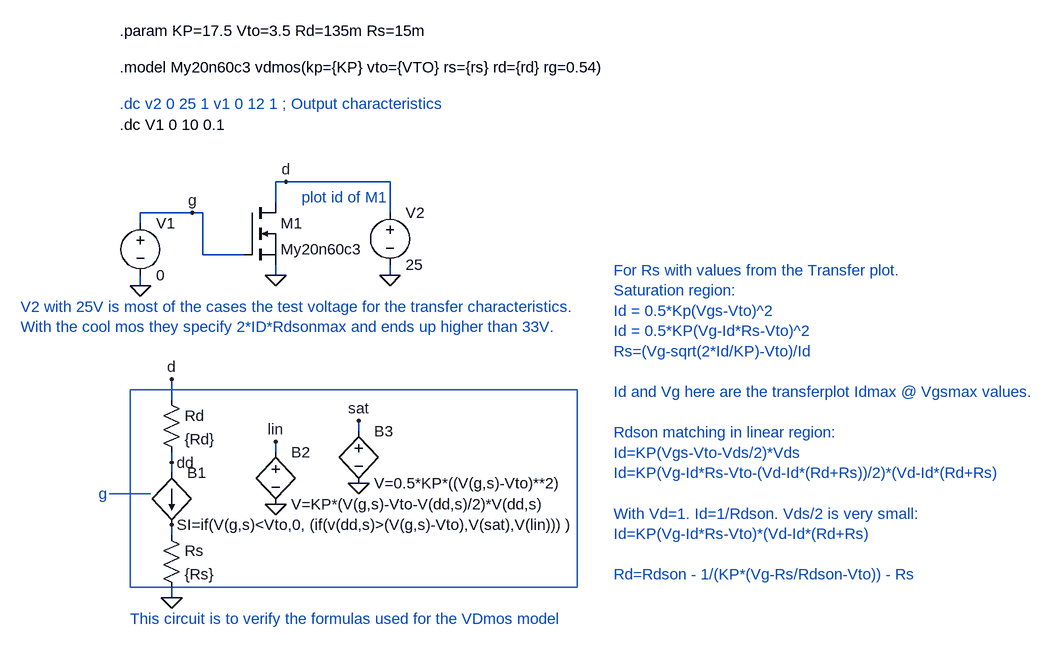
[diagram p0: schematic DC-level1.asc]
DC-level1.asc, the LTspice schematic file:
Version 4
SHEET 1 2604 832
WIRE 816 144 800 144
WIRE 976 144 816 144
WIRE 800 176 800 144
WIRE 672 192 592 192
WIRE 688 192 672 192
WIRE 976 192 976 144
WIRE 592 208 592 192
WIRE 688 256 688 192
WIRE 752 256 688 256
WIRE 800 288 800 272
WIRE 976 288 976 272
WIRE 592 304 592 288
WIRE 640 480 640 448
WIRE 928 528 928 512
WIRE 800 560 800 544
WIRE 640 576 640 560
WIRE 640 592 640 576
WIRE 640 688 640 672
WIRE 640 784 640 768
FLAG 800 288 0
FLAG 592 304 0
FLAG 976 288 0
FLAG 672 192 g
FLAG 816 144 d
FLAG 640 784 0
FLAG 640 448 d
FLAG 800 640 0
FLAG 928 608 0
FLAG 800 544 lin
FLAG 928 512 sat
FLAG 640 672 S
FLAG 640 576 dd
SYMBOL nmos 752 176 R0
SYMATTR InstName M1
SYMATTR Value My20n60c3
SYMBOL voltage 592 192 R0
WINDOW 123 0 0 Left 0
WINDOW 39 0 0 Left 0
SYMATTR InstName V1
SYMATTR Value 0
SYMBOL bi 640 592 R0
SYMATTR InstName B1
SYMATTR Value I=if(V(g,s)<Vto,0, (if(v(dd,s)>(V(g,s)-Vto),V(sat),V(lin))) )
SYMBOL res 624 672 R0
SYMATTR InstName Rs
SYMATTR Value {Rs}
SYMBOL res 624 464 R0
SYMATTR InstName Rd
SYMATTR Value {Rd}
SYMBOL bv 800 544 R0
SYMATTR InstName B2
SYMATTR Value V=KP*(V(g,s)-Vto-V(dd,s)/2)*V(dd,s)
SYMBOL bv 928 512 R0
SYMATTR InstName B3
SYMATTR Value V=0.5*KP*((V(g,s)-Vto)**2)
SYMBOL voltage 976 176 R0
WINDOW 123 0 0 Left 0
WINDOW 39 0 0 Left 0
SYMATTR InstName V2
SYMATTR Value 25
TEXT 560 -32 Left 0 !.model My20n60c3 vdmos(kp={KP} vto={VTO} rs={rs} rd={rd} rg=0.54)
TEXT 560 24 Left 0 ;.dc v2 0 25 1 v1 0 12 1 ; Output characteristics
TEXT 560 56 Left 0 !.dc V1 0 10 0.1
TEXT 840 168 Left 0 ;plot id of M1
TEXT 560 -88 Left 0 !.param KP=17.5 Vto=3.5 Rd=135m Rs=15m
TEXT 1320 280 Left 0 ;For Rs with values from the Transfer plot.\nSaturation region:\nId = 0.5*Kp(Vgs-Vto)^2\nId = 0.5*KP(Vg-Id*Rs-Vto)^2\nRs=(Vg-sqrt(2*Id/KP)-Vto)/Id\n \nId and Vg here are the transferplot Idmax @ Vgsmax values.\n \nRdson matching in linear region:\nId=KP(Vgs-Vto-Vds/2)*Vds\nId=KP(Vg-Id*Rs-Vto-(Vd-Id*(Rd+Rs))/2)*(Vd-Id*(Rd+Rs)\n \nWith Vd=1. Id=1/Rdson. Vds/2 is very small:\nId=KP(Vg-Id*Rs-Vto)*(Vd-Id*(Rd+Rs)\n \nRd=Rdson - 1/(KP*(Vg-Rs/Rdson-Vto)) - Rs
TEXT 528 624 Left 0 ;g
TEXT 576 816 Left 0 ;This circuit is to verify the formulas used for the VDmos model
TEXT 408 336 Left 0 ;V2 with 25V is most of the cases the test voltage for the transfer characteristics.\nWith the cool mos they specify 2*ID*Rdsonmax and ends up higher than 33V.
LINE Normal 544 624 608 624
RECTANGLE Normal 1264 768 576 464

The netlist it stands for:
* DC-level1.asc
M1 d g 0 0 My20n60c3
V1 g 0 0
B1 dd S I=if(V(g,s)<Vto,0, (if(v(dd,s)>(V(g,s)-Vto),V(sat),V(lin))) )
Rs S 0 {Rs}
Rd d dd {Rd}
B2 lin 0 V=KP*(V(g,s)-Vto-V(dd,s)/2)*V(dd,s)
B3 sat 0 V=0.5*KP*((V(g,s)-Vto)**2)
V2 d 0 25
.model NMOS NMOS
.model PMOS PMOS
.lib standard.mos
.model My20n60c3 vdmos(kp={KP} vto={VTO} rs={rs} rd={rd} rg=0.54)
* .dc v2 0 25 1 v1 0 12 1 ; Output characteristics
.dc V1 0 10 0.1
* plot id of M1
.param KP=17.5 Vto=3.5 Rd=135m Rs=15m
* For Rs with values from the Transfer plot.
* Saturation region:
* Id = 0.5*Kp(Vgs-Vto)^2
* Id = 0.5*KP(Vg-Id*Rs-Vto)^2
* Rs=(Vg-sqrt(2*Id/KP)-Vto)/Id
* Id and Vg here are the transferplot Idmax @ Vgsmax values.
* Rdson matching in linear region:
* Id=KP(Vgs-Vto-Vds/2)*Vds
* Id=KP(Vg-Id*Rs-Vto-(Vd-Id*(Rd+Rs))/2)*(Vd-Id*(Rd+Rs)
* With Vd=1. Id=1/Rdson. Vds/2 is very small:
* Id=KP(Vg-Id*Rs-Vto)*(Vd-Id*(Rd+Rs)
* Rd=Rdson - 1/(KP*(Vg-Rs/Rdson-Vto)) - Rs
* g
* This circuit is to verify the formulas used for the VDmos model
* V2 with 25V is most of the cases the test voltage for the transfer characteristics.
* With the cool mos they specify 2*ID*Rdsonmax and ends up higher than 33V.
.backanno
.end